# EAGLE design UNO_ESP8266_integrated (EAGLE 6.6.0)
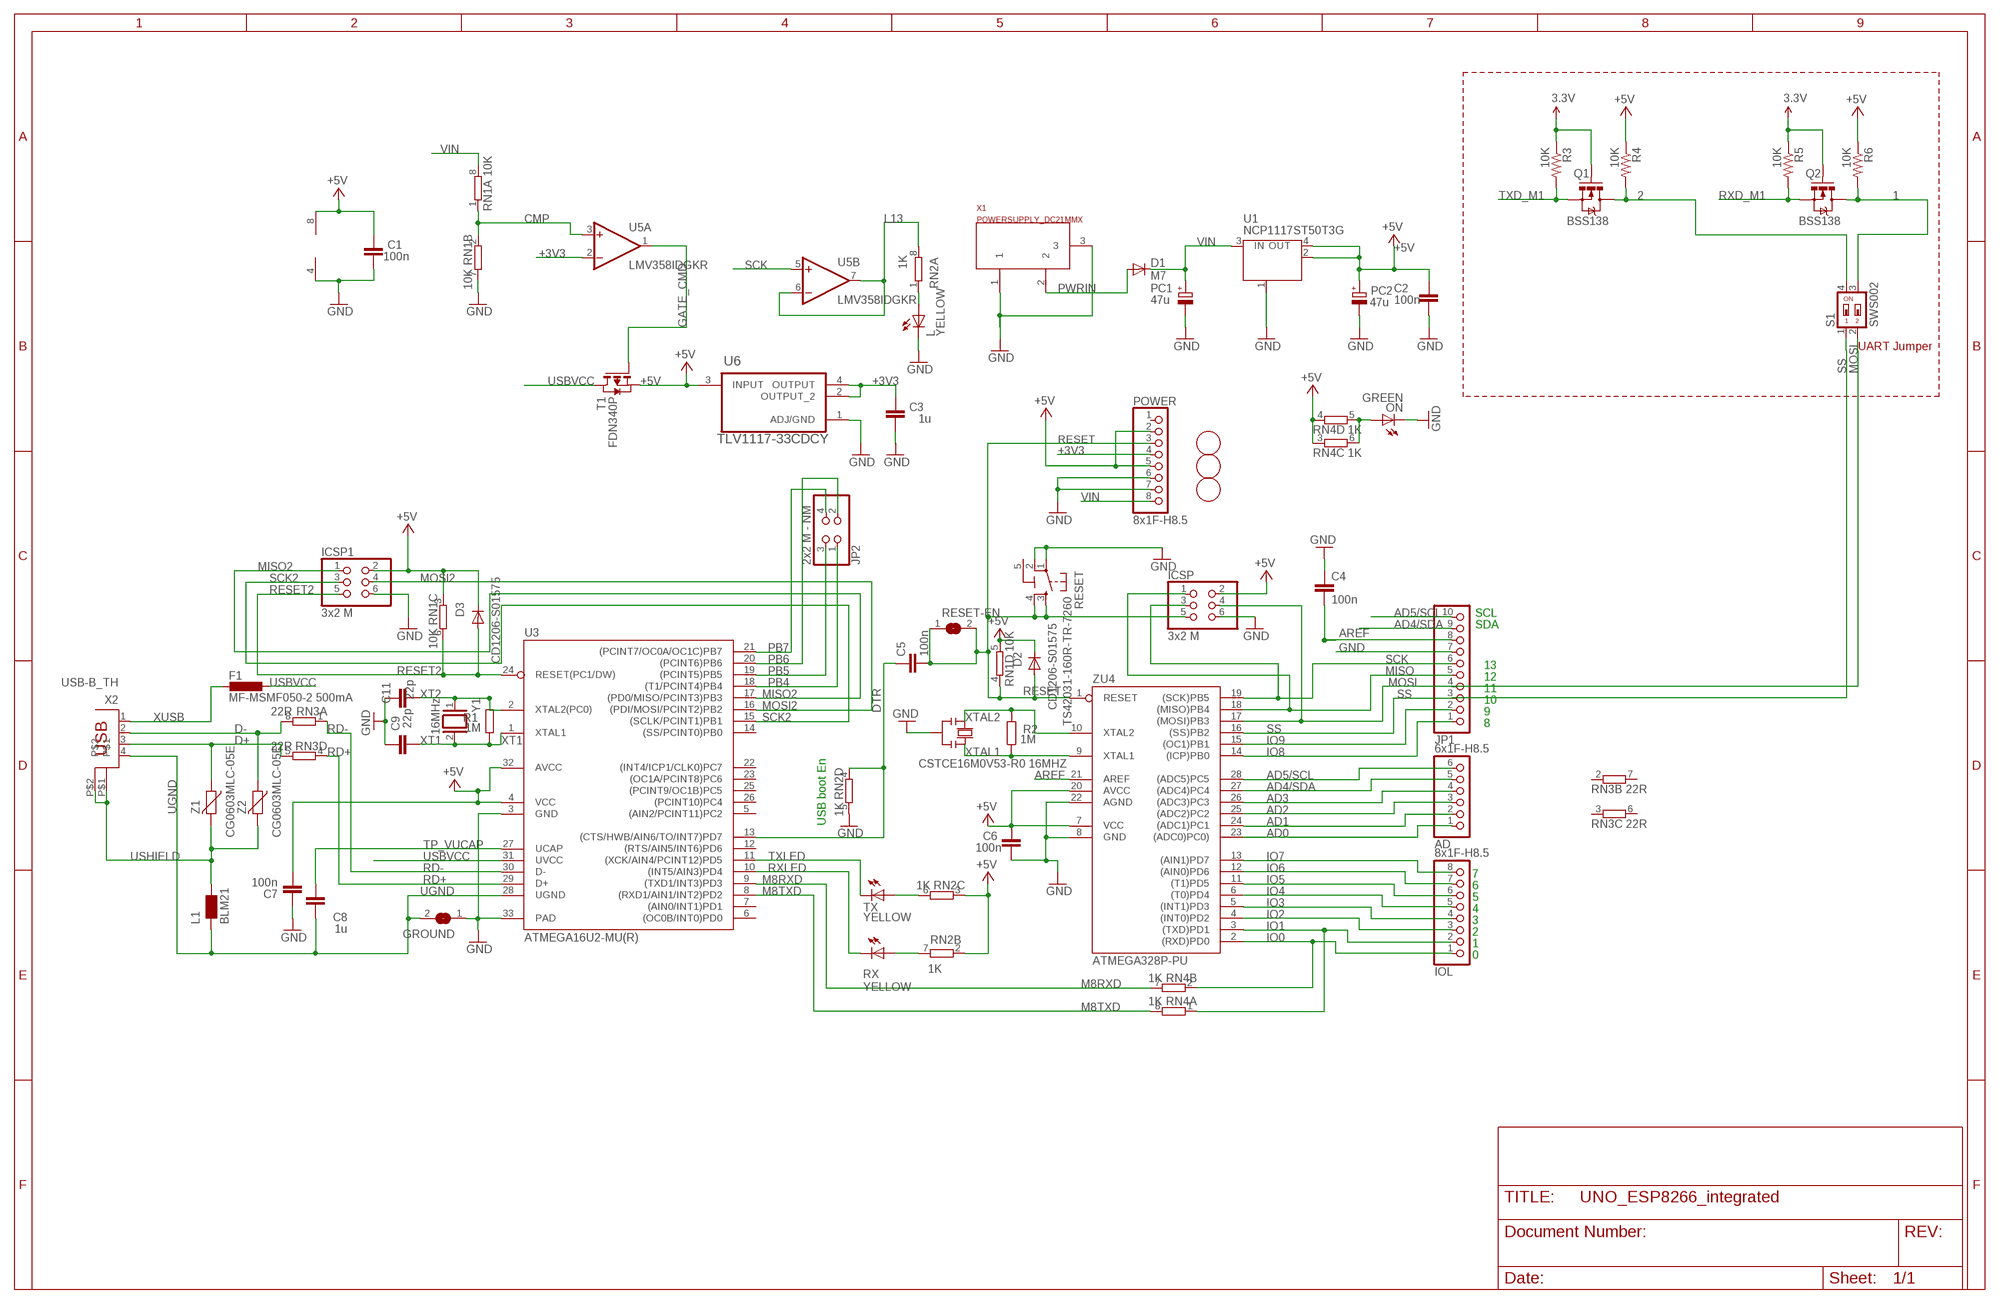
[diagram p0: schematic, sheet 1, part 1 of 2]
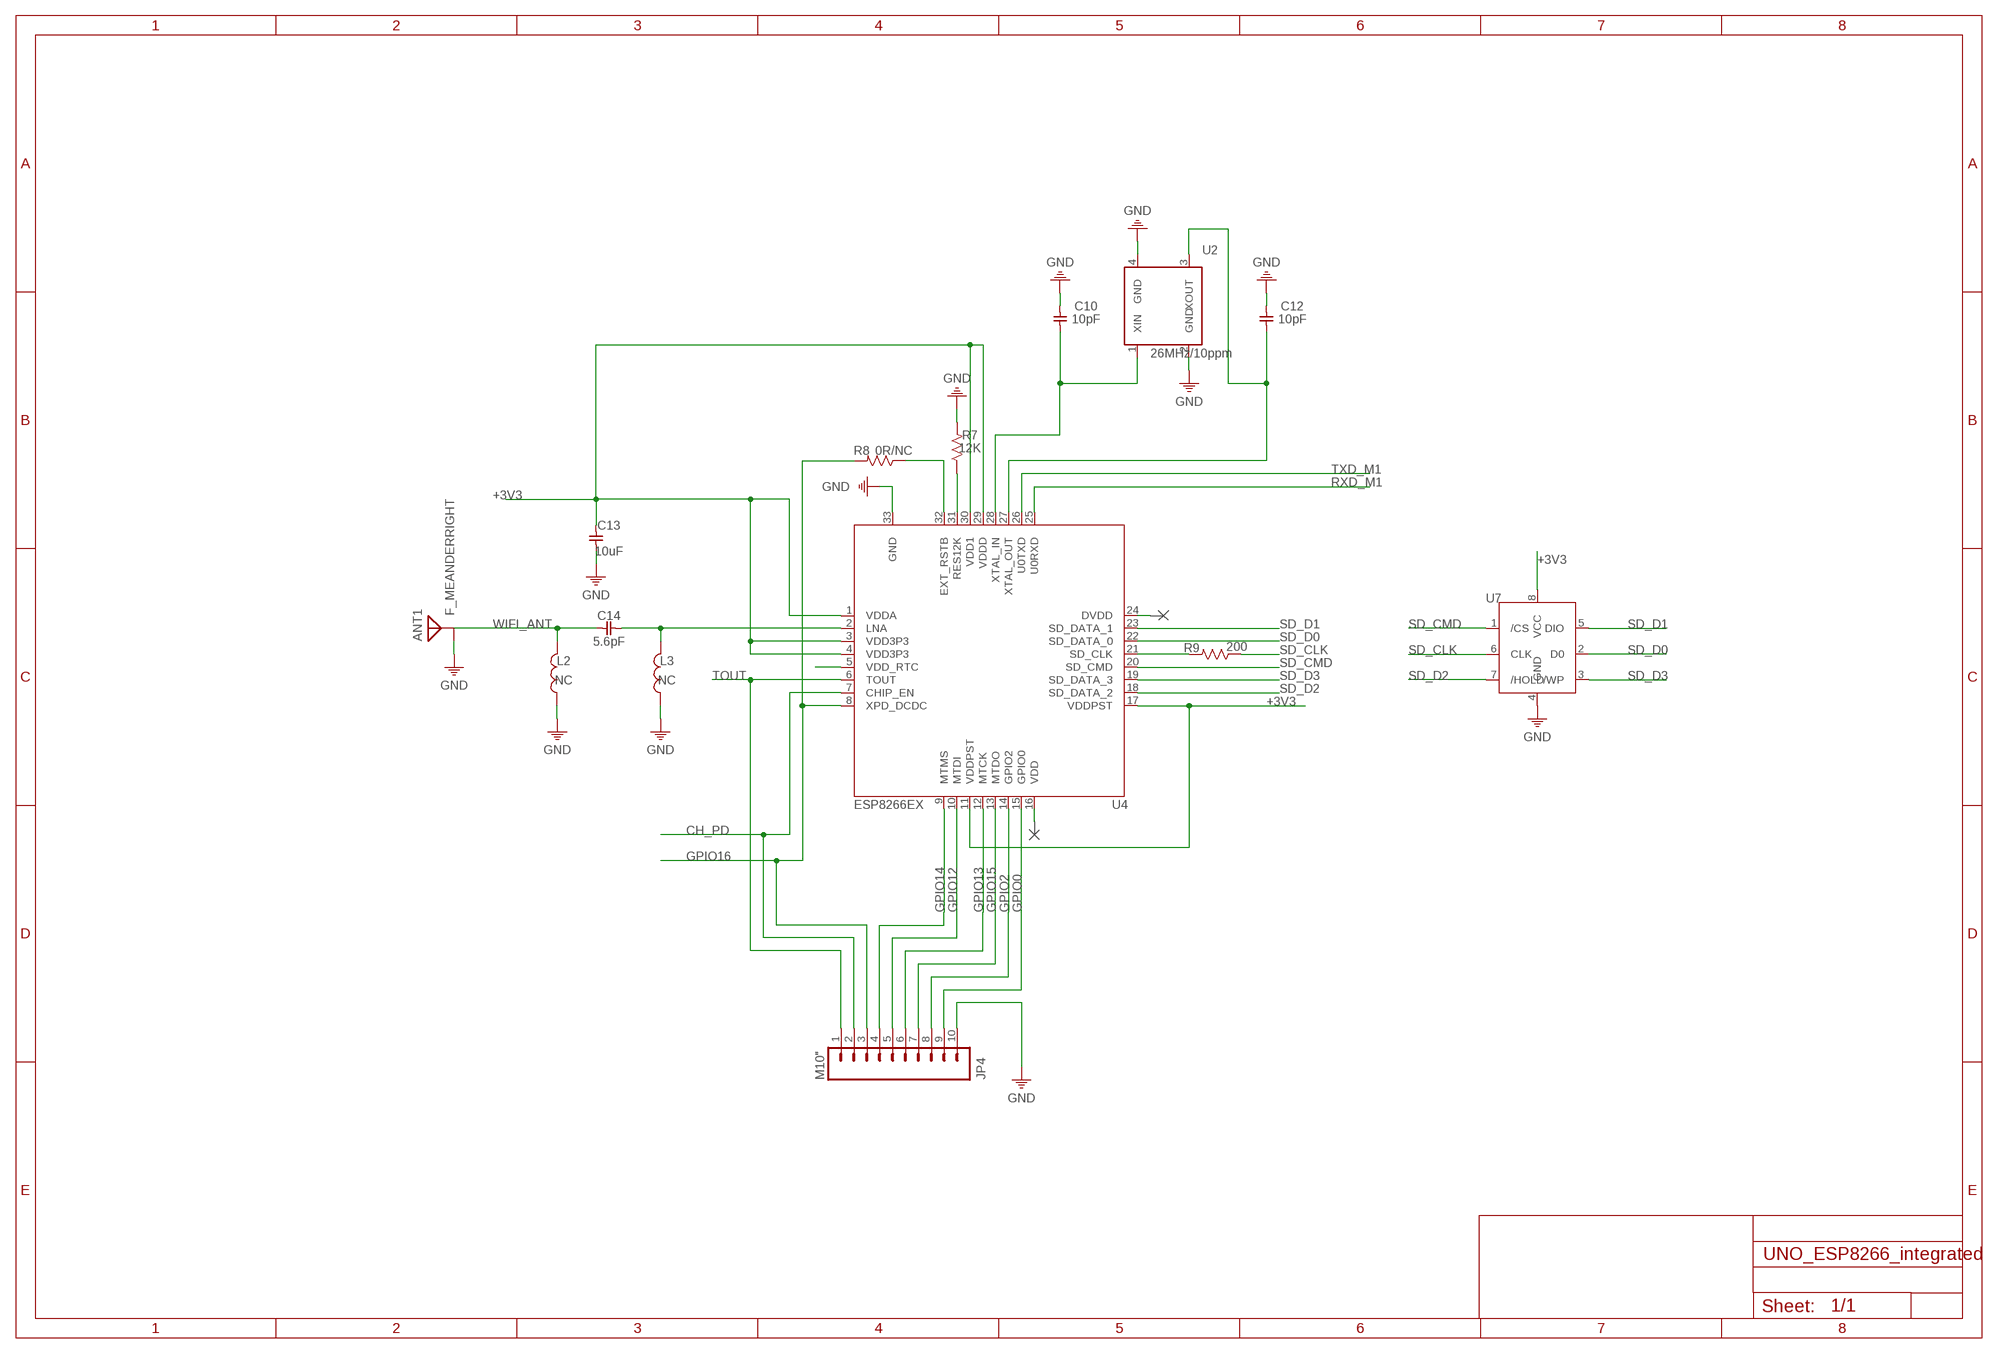
[diagram p1: schematic, sheet 1, part 2 of 2]
PORT1 (NC): BOM: EXCLUDE
PORT2 (NC): BOM: EXCLUDE

## Parts
AD  6x1F-H8.5  PINHD-1X6  [1X06]
ANT1  F_MEANDERRIGHT  [F_MEANDER_RIGHT]
C1  100n  C-EU0603-RND  [C0603-ROUND]
C2  100n  C-EU0603-RND  [C0603-ROUND]
C3  1u  C-EU0603-RND  [C0603-ROUND]
C4  100n  C-EU0603-RND  [C0603-ROUND]
C5  100n  C-EU0603-RND  [C0603-ROUND]
C6  100n  C-EU0603-RND  [C0603-ROUND]
C7  100n  C-EU0603-RND  [C0603-ROUND]
C8  1u  C-EU0603-RND  [C0603-ROUND]
C9  22p  C-EU0603-RND  [C0603-ROUND]
C10  10pF  CAP_0402  [C0402]
C11  22p  C-EU0603-RND  [C0603-ROUND]
C12  10pF  CAP_0402  [C0402]
C13  10uF  CAP_0402  [C0402]
C14  5.6pF  CAP_0402  [C0402]
D1  M7  DIODE-SMB  [SMB]
D2  CD1206-S01575  DIODE-MINIMELF  [MINIMELF]
D3  CD1206-S01575  DIODE-MINIMELF  [MINIMELF]
F1  MF-MSMF050-2 500mA  L-EUL1812  [L1812]
FD1  FIDUCIALMOUNT  [FIDUCIA-MOUNT]
FD2  FIDUCIALMOUNT  [FIDUCIA-MOUNT]
FD3  FIDUCIALMOUNT  [FIDUCIA-MOUNT]
GROUND  SJ  [SJ]
ICSP  3x2 M  PINHD-2X3  [2X03]
ICSP1  3x2 M  PINHD-2X3  [2X03]
IOL  8x1F-H8.5  PINHD-1X8  [1X08]
JP1  PINHD-1X10_ARD  [1X10]
JP2  2x2 M - NM  PINHD-2X2  [2X02]
JP4  M10"  [1X10]
L  YELLOW  LEDCHIP-LED0805  [CHIP-LED0805]
L1  BLM21  WE-CBF_0805  [0805]
L2  NC  FB_0603  [FB0603]
L3  NC  FB_0603  [FB0603]
ON  GREEN  LEDCHIP-LED0805  [CHIP-LED0805]
PC1  47u  CPOL-EUD  [PANASONIC_D]
PC2  47u  CPOL-EUD  [PANASONIC_D]
POWER  8x1F-H8.5  PINHD-1X8  [1X08]
Q1  BSS138  MOSFET-NCHANNELSMD  [SOT23-3]
Q2  BSS138  MOSFET-NCHANNELSMD  [SOT23-3]
R1  1M  R-EU_R0603  [R0603-ROUND]
R2  1M  R-EU_R0603  [R0603-ROUND]
R3  10K  RESISTOR0603-RES  [0603-RES]
R4  10K  RESISTOR0603-RES  [0603-RES]
R5  10K  RESISTOR0603-RES  [0603-RES]
R6  10K  RESISTOR0603-RES  [0603-RES]
R7  12K  RES_0402  [R0402]
R8  0R/NC  RES_0402  [R0402]
R9  200  RES_0402  [R0402]
RESET  TS42031-160R-TR-7260  TS42  [TS42]
RESET-EN  SJ  [SJ]
RN1  10K  4R-NCAY16  [CAY16]
RN2  1K  4R-NCAY16  [CAY16]
RN3  22R  4R-NCAY16  [CAY16]
RN4  1K  4R-NCAY16  [CAY16]
RX  YELLOW  LEDCHIP-LED0805  [CHIP-LED0805]
S1  SWS002  [SMS-002]
T1  FDN340P  PMOSSOT23  [SOT-23]
TX  YELLOW  LEDCHIP-LED0805  [CHIP-LED0805]
U1  NCP1117ST50T3G  MC33269ST-3.3T3  [SOT223]
U2  26MHz/10ppm  CRYSTAL_2SH  [CRYSTAL_32X25]
U3  ATMEGA16U2-MU(R)  ATMEGA16U2-MU  [MLF32]
U4  ESP8266EX  [QFN32]
U5  LMV358IDGKR  LMV358MMX  [MSOP08]
U6  TLV1117-33CDCY  [SOT230P700X180-4N]
U7  SPI_FLASH  [SOIC-8]
X1  POWERSUPPLY_DC21MMX  [POWERSUPPLY_DC-21MM]
X2  USB-B_TH  PN61729  [PN61729]
Y1  16MHz  XTAL/S  [QS]
Y2  CSTCE16M0V53-R0 16MHZ  RESONATORMU  [RESONATOR]
Z1  CG0603MLC-05E  VARISTORCN0603  [CT/CN0603]
Z2  CG0603MLC-05E  VARISTORCN0603  [CT/CN0603]
ZU4  ATMEGA328P-PU  [DIL28-3]

## Nets
1: Q2.3(D) R6.2 S1.3
2: Q1.3(D) R4.2 S1.4
+3V3: C3.2 C13.2 POWER.4 Q1.1(G) Q2.1(G) R3.1 R5.1 U4.1(VDDA) U4.3(VDD3P3) U4.4(VDD3P3) U4.11(VDDPST) U4.17(VDDPST) U4.29(VDDD) U4.30(VDD1) U5.2(A:-IN) U6.2(OUTPUT_2) U6.4(OUTPUT) U7.8(VCC) ; supply symbol labelled 3.3V
+5V [usbvcc]: C1.2 C2.2 C6.2 C7.1 D2.C D3.C ICSP1.2 ICSP.2 PC2.+ POWER.2 POWER.5 R4.1 R6.1 RN1.3 RN1.5 RN2.2 RN2.3 RN4.3 RN4.4 T1.2(S) U1.2(OUT) U1.4(OUT) U3.4(VCC) U3.32(AVCC) U5.8(P:V+) U6.3(INPUT) ZU4.7(VCC) ZU4.20(AVCC)
AD0: AD.1 ZU4.23((ADC0)PC0))
AD1: AD.2 ZU4.24((ADC1)PC1)
AD2: AD.3 ZU4.25((ADC2)PC2)
AD3: AD.4 ZU4.26((ADC3)PC3)
AD4/SDA: AD.5 JP1.9 ZU4.27((ADC4)PC4)
AD5/SCL: AD.6 JP1.10 ZU4.28((ADC5)PC5)
AREF [aref]: C4.2 JP1.8 ZU4.21(AREF)
CH_PD: JP4.2 U4.7(CHIP_EN)
CMP: RN1.1 RN1.2 U5.3(A:+IN)
D+: RN3.5 X2.3 Z1.1
D-: RN3.8 X2.2 Z2.1
DTR: C5.1 RN2.4 U3.13((CTS/HWB/AIN6/TO/INT7)PD7)
GATE_CMD: T1.3(G) U5.1(A:OUT)
GND [gnd]: ANT1.GND C1.1 C2.1 C3.1 C4.1 C6.1 C7.2 C9.2 C10.2 C11.2 C12.2 C13.1 GROUND.1 ICSP1.6 ICSP.6 JP1.7 JP4.10 L2.1 L3.1 L.C ON.C PC1.- PC2.- POWER.6 POWER.7 R7.2 RESET.1 RESET.2 RN1.7 RN2.5 U1.1(GND/ADJ) U2.2(GND) U2.4(GND) U3.3(GND) U3.33(PAD) U4.33(GND) U5.4(P:V-) U6.1(ADJ/GND) U7.4(GND) X1.1 X1.3 Y2.2 ZU4.8(GND) ZU4.22(AGND)
GPIO0: JP4.9 U4.15(GPIO0)
GPIO2: JP4.8 U4.14(GPIO2)
GPIO12: JP4.5 U4.10(MTDI)
GPIO13: JP4.6 U4.12(MTCK)
GPIO14: JP4.4 U4.9(MTMS)
GPIO15: JP4.7 U4.13(MTDO)
GPIO16: JP4.3 R8.2 U4.8(XPD_DCDC)
IO0: IOL.1 RN4.2 ZU4.2((RXD)PD0)
IO1: IOL.2 RN4.1 ZU4.3((TXD)PD1)
IO2: IOL.3 ZU4.4((INT0)PD2)
IO3: IOL.4 ZU4.5((INT1)PD3)
IO4: IOL.5 ZU4.6((T0)PD4)
IO5: IOL.6 ZU4.11((T1)PD5)
IO6: IOL.7 ZU4.12((AIN0)PD6)
IO7: IOL.8 ZU4.13((AIN1)PD7)
IO8: JP1.1 ZU4.14((ICP)PB0)
IO9: JP1.2 ZU4.15((OC1)PB1)
L13: RN2.8 U5.6(B:-IN) U5.7(B:OUT)
M8RXD: RN4.7 U3.9((TXD1/INT3)PD3)
M8TXD: RN4.8 U3.8((RXD1/AIN1/INT2)PD2)
MISO: ICSP.1 JP1.5 ZU4.18((MISO)PB4)
MISO2: ICSP1.1 U3.17((PD0/MISO/PCINT3)PB3)
MOSI: ICSP.4 JP1.4 S1.2 ZU4.17((MOSI)PB3)
MOSI2: ICSP1.4 U3.16((PDI/MOSI/PCINT2)PB2)
N$1: L.A RN2.1
N$2: R8.1 U4.32(EXT_RSTB)
N$3: ON.A RN4.5 RN4.6
N$4: R7.1 U4.31(RES12K)
N$5: U4.5(VDD_RTC)
N$6: U4.16(VDD)
N$7: U4.24(DVDD)
N$8: C14.1 L3.2 U4.2(LNA)
N$9: C10.1 U2.1(XIN) U4.28(XTAL_IN)
N$10: R9.2 U4.21(SD_CLK)
N$11: C12.1 U2.3(XOUT) U4.27(XTAL_OUT)
N$35: RN2.7 RX.A
N$36: RN2.6 TX.A
PB4: JP2.1 U3.18((T1/PCINT4)PB4)
PB5: JP2.3 U3.19((PCINT5)PB5)
PB6: JP2.2 U3.20((PCINT6)PB6)
PB7: JP2.4 U3.21((PCINT7/OC0A/OC1C)PB7)
PWRIN [power]: D1.A X1.2
RD+: RN3.4 U3.29(D+)
RD-: RN3.1 U3.30(D-)
RESET: C5.2 D2.A ICSP.5 POWER.3 RESET-EN.1 RESET-EN.2 RESET.3 RESET.4 RN1.4 ZU4.1(RESET)
RESET2: D3.A ICSP1.5 RN1.6 U3.24(RESET(PC1/DW))
RXD_M1: Q2.2(S) R5.2 U4.25(U0RXD)
RXLED: RX.C U3.10((INT5/AIN3)PD4)
SCK: ICSP.3 JP1.6 U5.5(B:+IN) ZU4.19((SCK)PB5)
SCK2: ICSP1.3 U3.15((SCLK/PCINT1)PB1)
SD_CLK: R9.1 U7.6(CLK)
SD_CMD: U4.20(SD_CMD) U7.1(/CS)
SD_D0: U4.22(SD_DATA_0) U7.2(D0)
SD_D1: U4.23(SD_DATA_1) U7.5(DIO)
SD_D2: U4.18(SD_DATA_2) U7.7(/HOLD)
SD_D3: U4.19(SD_DATA_3) U7.3(/WP)
SS: JP1.3 S1.1 ZU4.16((SS)PB2)
TOUT: JP4.1 U4.6(TOUT)
TP_VUCAP: C8.1 U3.27(UCAP)
TXD_M1: Q1.2(S) R3.2 U4.26(U0TXD)
TXLED: TX.C U3.11((XCK/AIN4/PCINT12)PD5)
UGND [gnd]: C8.2 GROUND.2 L1.1 U3.28(UGND) X2.4
USBVCC [usbvcc]: F1.1 T1.1(D) U3.31(UVCC)
USHIELD [gnd]: L1.2 X2.P$1 X2.P$2 Z1.2 Z2.2
VIN [power]: D1.C PC1.+ POWER.8 RN1.8 U1.3(IN)
WIFI_ANT: ANT1.RF C14.2 L2.2
XT1: C9.1 R1.1 U3.1(XTAL1) Y1.2
XT2: C11.1 R1.2 U3.2(XTAL2(PC0)) Y1.1
XTAL1: R2.1 Y2.3 ZU4.9(XTAL1)
XTAL2: R2.2 Y2.1 ZU4.10(XTAL2)
XUSB [usbvcc]: F1.2 X2.1
Unconnected: POWER.1 RN3.2 RN3.3 RN3.6 RN3.7 U3.5((AIN2/PCINT11)PC2) U3.6((OC0B/INT0)PD0) U3.7((AIN0/INT1)PD1) U3.12((RTS/AIN5/INT6)PD6) U3.14((SS/PCINT0)PB0) U3.22((INT4/ICP1/CLK0)PC7) U3.23((OC1A/PCINT8)PC6) U3.25((PCINT9/OC1B)PC5) U3.26((PCINT10)PC4)

## Notes on the sheet
- UART Jumper
- SCL
- SDA
- 13
- 12
- 11
- 10
- 9
- 8
- USB boot En
- 7
- 6
- 5
- 4
- 3
- 2
- 1
- 0

## Power pins joined to a net without a drawn wire
5-GND: RESET.5(5-GND)

## Library data of the parts
AD = SmartPrj:PINHD-1X6: PIN HEADER
ANT1 = ant-planar-1:F_MEANDER
C1-C9 C11 = SmartPrj:C-EU: CAPACITOR, European symbol
C10 C12-C14 = ESP8266:CAP_: Capacitor; SIZE: 0402
D1-D3 = diode:DIODE-: DIODE
F1 = rcl:L-EU: INDUCTOR, European symbol
FD1-FD3 = SmartPrj:FIDUCIALMOUNT
GROUND RESET-EN = jumper:SJ: SMD solder JUMPER
ICSP ICSP1 = SmartPrj:PINHD-2X3: PIN HEADER
IOL POWER = SmartPrj:PINHD-1X8: PIN HEADER
JP1 = SmartPrj:PINHD-1X10_ARD: PIN HEADER
JP2 = SmartPrj:PINHD-2X2: PIN HEADER
JP4 = SparkFun-Connectors:M10: Header 10 Standard 10-pin 0.1" header. Use with straight break away headers (SKU : PRT-00116), right angle break away headers (PRT-00553), swiss pins (PRT-00743), machine pins (PRT-00117), and female headers (PRT-00115).
L ON RX TX = led:LED: LED OSRAM: - CHIPLED LG R971, LG N971, LY N971, LG Q971, LY Q971, LO R971, LY R971 LH N974, LH R974 LS Q976, LO Q976, LY Q976 LO Q996 - Hyper CHIPLED LW Q18S LB Q993, LB Q99A, LB R99A - SideLED LS A670, LO A670, LY A670, LG A670, LP A670 LB A673, LV A673, LT A673, LW A673 LH A674 LY A675 LS A676, LA A676, LO A676, LY A676, LW A676 LS A679, LY A679, LG A679 - Hyper Micro SIDELED® LS Y876, LA Y876, LO Y876, LY Y876 LT Y87S - SmartLED LW L88C, LW L88S LB L89C, LB L89S, LG L890 LS L89K, LO L89K, LY L89K LS L896, LA L896, LO L896, LY L896 - TOPLED LS T670, LO T670, LY T670, LG T670, LP T670 LSG T670, LSP T670, LSY T670, LOP T670, LYG T670 LG T671, LOG T671, LSG T671 LB T673, LV T673, LT T673, LW T673 LH T674 LS T676, LA T676, LO T676, LY T676, LB T676, LH T676, LSB T676, LW T676 LB T67C, LV T67C, LT T67C, LS T67K, LO T67K, LY T67K, LW E67C LS E67B, LA E67B, LO E67B, LY E67B, LB E67C, LV E67C, LT E67C LW T67C LS T679, LY T679, LG T679 LS T770, LO T770, LY T770, LG T770, LP T770 LB T773, LV T773, LT T773, LW T773 LH T774 LS E675, LA E675, LY E675, LS T675 LS T776, LA T776, LO T776, LY T776, LB T776 LHGB T686 LT T68C, LB T68C - Hyper Mini TOPLED® LB M676 - Mini TOPLED Santana® LG M470 LS M47K, LO M47K, LY M47K Source: http://www.osram.convergy.de LUXEON: - LUMILED® LXK2-PW12-R00, LXK2-PW12-S00, LXK2-PW14-U00, LXK2-PW14-V00 LXK2-PM12-R00, LXK2-PM12-S00, LXK2-PM14-U00 LXK2-PE12-Q00, LXK2-PE12-R00, LXK2-PE12-S00, LXK2-PE14-T00, LXK2-PE14-U00 LXK2-PB12-K00, LXK2-PB12-L00, LXK2-PB12-M00, LXK2-PB14-N00, LXK2-PB14-P00, LXK2-PB14-Q00 LXK2-PR12-L00, LXK2-PR12-M00, LXK2-PR14-Q00, LXK2-PR14-R00 LXK2-PD12-Q00, LXK2-PD12-R00, LXK2-PD12-S00 LXK2-PH12-R00, LXK2-PH12-S00 LXK2-PL12-P00, LXK2-PL12-Q00, LXK2-PL12-R00 Source: www.luxeon.com KINGBRIGHT: KA-3528ASYC Source: www.kingbright.com
L1 = wuerth-elektronik:WE-CBF: SMD EMI Suppression Ferrite Beads - excellent anti-EMI properties - low DCR - impedances till 3000 ohms - rated current up to 6 A
L2 L3 = ESP8266:FB_: Ferrite Bead; SIZE: 0603
PC1 PC2 = rcl:CPOL-EU: POLARIZED CAPACITOR, European symbol
Q1 Q2 = SparkFun:MOSFET-NCHANNEL
R1 R2 = SmartPrj:R-EU_: RESISTOR, European symbol
R3-R6 = SparkFun:RESISTOR: Resistor Basic schematic elements and footprints for 0603, 1206, and PTH resistors.
R7-R9 = ESP8266:RES_: Resistor; SIZE: 0402
RESET = SmartPrj:TS42: TS42 Dongnan Electronics Tact switch VDC 12V - 50mA
RN1-RN4 = resistor-dil:4R-N: Array Chip Resistor Source: RS Component / Phycomp
S1 = smd-special:SWS002: SMD Dip Switch 2 pol.
T1 = zetex:PMOSSOT23: MOS FET
U1 = linear:MC33269ST*: Adjustable Output Low Dropout Voltage Regulator 800 mA Source: http://www.onsemi.com/pub/Collateral/MC33269-D.PDF
U2 = ESP8266:CRYSTAL_2SH: Crystal with 2 Shield Pads
U3 = SmartPrj:ATMEGA16U2-
U4 = ESP8266:ESP8266: 802.11bgn Smart Device
U5 = linear:LMV358?*: Dual General Purpose, Low Voltage, Rail-to-Rail Output Operational Amplifiers Source: http://www.national.com/mpf/LM/LMV321.html http://www.national.com/dt/lmv_qual.pdf
U6 = TLV1117-33CDCY:TLV1117-33CDCY: V REG, LDO, 3.3V, 0.8A; MPN: TLV1117-33CDCY; OC_FARNELL: 1494942; OC_NEWARK: 67K8520; PACKAGE: SOT-223-3; SUPPLIER: TEXAS INSTRUMENTS
U7 = ESP8266:SPI_FLASH: SPI Flash
X1 = SmartPrj:POWERSUPPLY_DC21MM
X2 = SmartPrj:PN61729: BERG USB connector
Y1 = SmartPrj:XTAL/S: CRYSTAL
Y2 = SmartPrj:RESONATOR
Z1 Z2 = varistor:VARISTOR: VARISTOR
ZU4 = SmartPrj:ATMEGA328P-: MICROCONTROLLER 4 Kbytes FLASH 128 bytes SRAM 256 bytes EEPROM UART 6-channel 10 bit ADC

## Net classes
0 default: width 0.2 mm, drill 0.2 mm, clearance 0.2 mm
1 power: width 0.2 mm, drill 0.2 mm, clearance 0.2 mm
2 gnd: width 0.2 mm, drill 0.2 mm, clearance 0.2 mm
3 usbvcc: width 0.2 mm, drill 0.2 mm, clearance 0.2 mm
4 aref: width 0.2 mm, drill 0.2 mm, clearance 0.2 mm

## Board
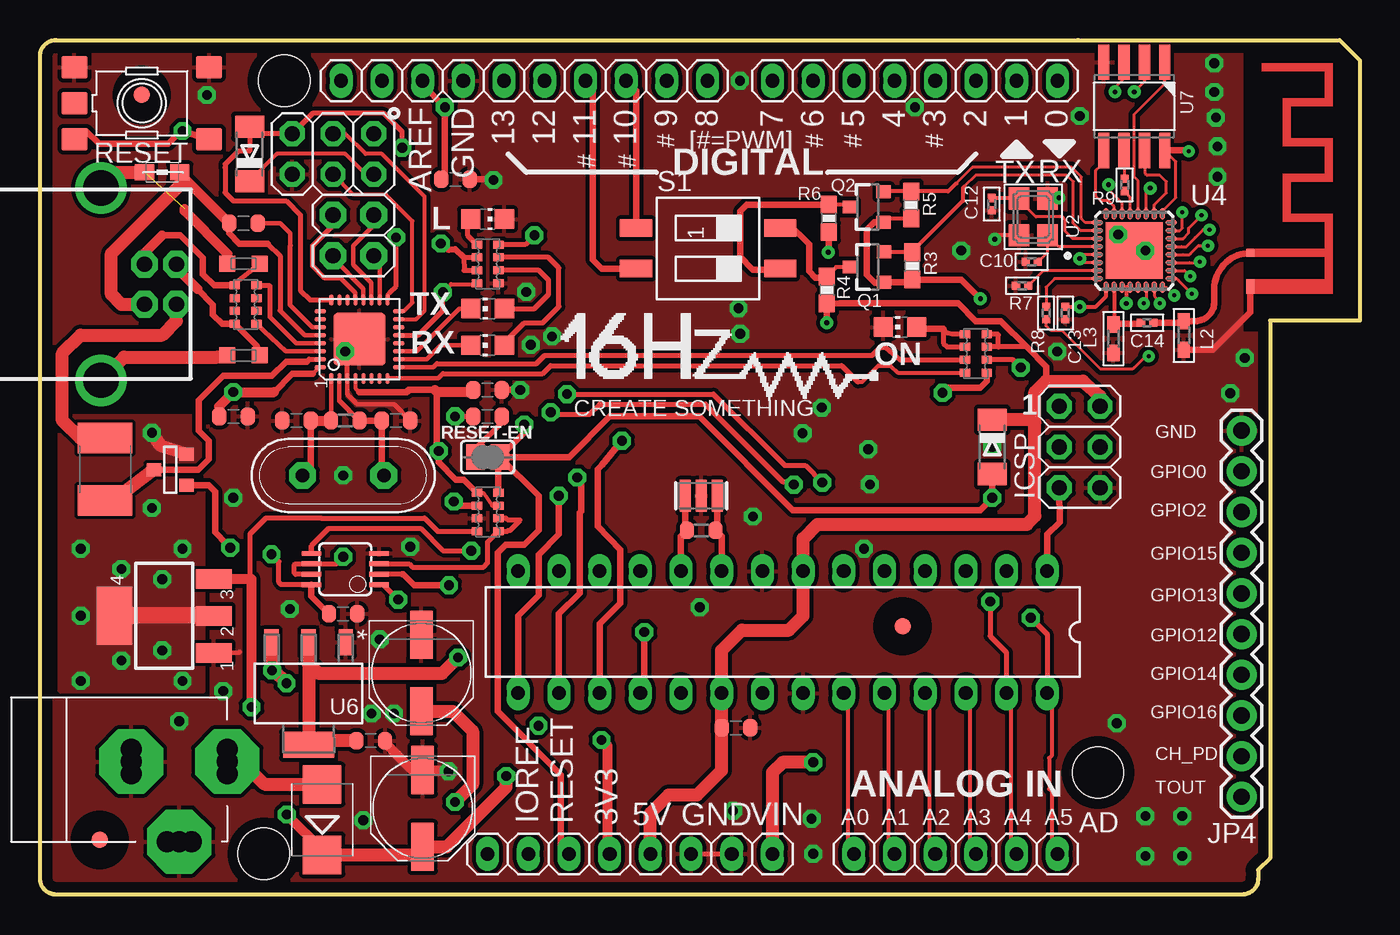
[diagram p2: board, top side]
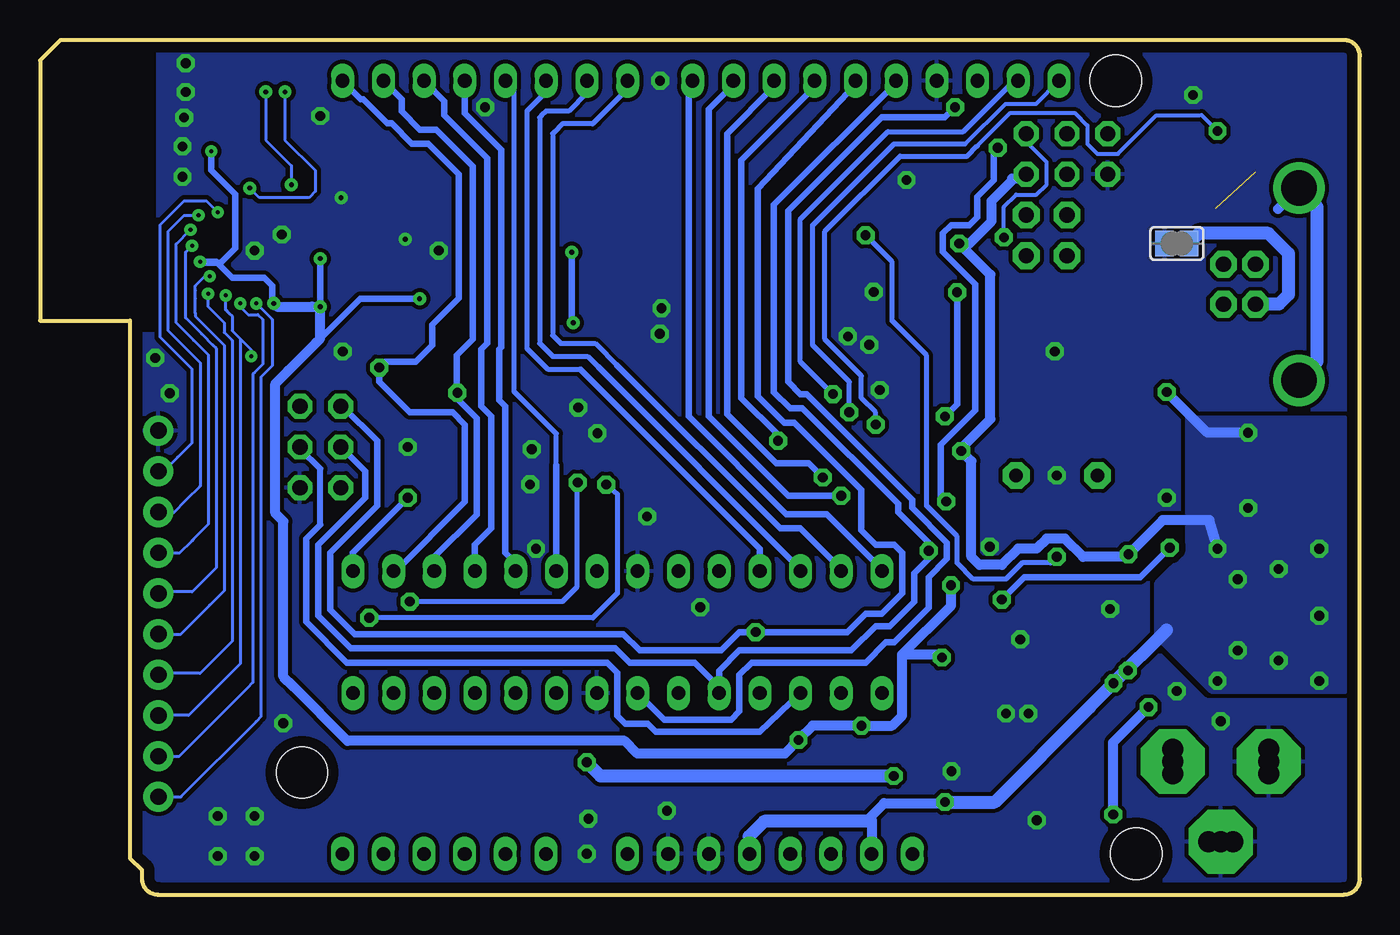
[diagram p3: board, bottom side, seen from below]

Size 82.39 x 53.34 mm. Coordinates in mm from the lower left corner, seen from the top.
Outline: 64.77,53.34 1,53.34 arc90 0,52.34 0,1 arc90 1,0 75.04,0 arc90 76.04,1 76.04,1.54 76.78,2.28 76.78,35.83 82.39,35.83 82.39,52.07 81.12,53.34 64.77,53.34
Outline: 64.77,53.34 64.82,53.34
Copper layers (1*16): Top 0.035mm / dielectric 1.5mm / Bottom 0.035mm
Design rules "default *": minimum track width 0.2mm, minimum drill 10mil, track to track 0.16mm, track to pad 0.16mm, pad to pad 0.16mm, via to via 0.16mm, smd to smd 0.16mm, copper to edge 26mil, drill to drill 12mil, minimum pad ring 10mil, minimum via ring 10mil, stop-mask expansion 1mil, vias tented up to drill 30mil, thermal gap 10mil
Holes 3.2 mm at 66.04,7.62 15.24,50.8 13.97,2.54
vRestrict: area 22.9,44.1 to 24.7,49.2; area 25.4,45.5 to 27.1,49.2; area 28.5,45.4 to 29.6,48.8; area 31,45.4 to 32.2,48.8; area 33.6,45.4 to 34.7,48.8; area 36.1,45.4 to 37.3,48.8; area 38.8,47.3 to 39.9,48.8; area 40.3,45.1 to 47.7,46.9; area 60.4,44.2 to 61.8,46.8; area 62.9,44.2 to 64.3,46.8; area 61.4,35.8 to 64.8,37.2; area 0.7,21.9 to 2.1,30.1; 14 more areas

### Footprints (pad centres in the part's own frame; a part is rotated, then mirrored left to right if it is on the bottom)
1X06 = drill 0.85 pad 1.422 long: 1 -6.35,0; 2 -3.81,0; 3 -1.27,0; 4 1.27,0; 5 3.81,0; 6 6.35,0
F_MEANDER_RIGHT = smd 0.9 x 0.5: GND -0.45,-0.25 | smd 0.5 x 0.5: RF -2.55,-0.25
C0603-ROUND = smd 0.898 x 1.1: 1 -0.889,0; 2 0.889,0
C0402 = smd 0.508 x 0.508: 1 -0.381,0; 2 0.381,0
SMB = smd 2.4 x 2.4: A 2.2,0; C -2.2,0
MINIMELF = smd 1.4 x 1.8: A 1.7,0; C -1.7,0
L1812 = smd 1.9 x 3.4: 1 -1.95,0; 2 1.95,0
FIDUCIA-MOUNT = smd 1.016 x 1.016: P$1 0,0
SJ = smd 1.168 x 1.6: 1 -0.762,0; 2 0.762,0
2X03 = drill 0.95 pad 1.55 octagon: 1 -2.54,-1.27; 2 -2.54,1.27; 3 0,-1.27; 4 0,1.27; 5 2.54,-1.27; 6 2.54,1.27
1X08 = drill 0.85 pad 1.422 long: 1 -8.89,0; 2 -6.35,0; 3 -3.81,0; 4 -1.27,0; 5 1.27,0; 6 3.81,0; 7 6.35,0; 8 8.89,0
1X10 = drill 0.85 pad 1.422 long: 1 -11.43,0; 2 -8.89,0; 3 -6.35,0; 4 -3.81,0; 5 -1.27,0; 6 1.27,0; 7 3.81,0; 8 6.35,0; 9 8.89,0; 10 11.43,0
2X02 = drill 0.95 pad 1.676 octagon: 1 -1.27,-1.27; 2 -1.27,1.27; 3 1.27,-1.27; 4 1.27,1.27
1X10' = drill 1.016 pad 1.88: 1 0,0; 2 2.54,0; 3 5.08,0; 4 7.62,0; 5 10.16,0; 6 12.7,0; 7 15.24,0; 8 17.78,0; 9 20.32,0; 10 22.86,0
CHIP-LED0805 = smd 1.2 x 1.2: A 0,-1.05; C 0,1.05
0805 = smd 1.2 x 1: 1 -1.1,0; 2 1.1,0
FB0603 = smd 1.016 x 0.762: 1 -0.889,0; 2 0.889,0
PANASONIC_D = smd 3 x 1.4: + 2.4,0; - -2.4,0
SOT23-3 = smd 0.8 x 0.9: 1 -0.95,-1; 2 0.95,-1; 3 0,1.1
R0603-ROUND = smd 0.898 x 1.1: 1 -0.889,0; 2 0.889,0
0603-RES = smd 1.1 x 1: 1 -0.85,0; 2 0.85,0
R0402 = smd 0.508 x 0.508: 1 -0.381,0; 2 0.381,0
TS42 = smd 1.6 x 1.4: 1 -4.2,2.25; 2 4.2,2.25; 3 -4.2,-2.25; 4 4.2,-2.25; 5 -4.2,0
CAY16 = smd 0.5 x 0.65: 1 -1.2,-0.675; 2 -0.4,-0.675; 3 0.4,-0.675; 4 1.2,-0.675; 5 1.2,0.675; 6 0.4,0.675; 7 -0.4,0.675; 8 -1.2,0.675
SMS-002 = smd 1.092 x 2.007: 1 -1.27,-4.496; 2 1.27,-4.496; 3 1.27,4.496; 4 -1.27,4.496
SOT-23 = smd 0.787 x 0.889: 1 0.025,-1.016; 2 -0.94,1.016; 3 0.991,1.016
SOT223 = smd 1.219 x 2.235: 1 -2.311,-3.099; 2 0,-3.099; 3 2.311,-3.099 | smd 3.6 x 2.2: 4 0,3.099
CRYSTAL_32X25 = smd 1.27 x 1.397: 1 -0.889,1.143; 2 -0.889,-1.143; 3 0.889,-1.143; 4 0.889,1.143
MLF32 = smd 0.7 x 0.28: 1 -2.45,1.75; 2 -2.45,1.25; 3 -2.45,0.75; 4 -2.45,0.25; 5 -2.45,-0.25; 6 -2.45,-0.75; 7 -2.45,-1.25; 8 -2.45,-1.75; 17 2.45,-1.75; 18 2.45,-1.25; 19 2.45,-0.75; 20 2.45,-0.25; 21 2.45,0.25; 22 2.45,0.75; 23 2.45,1.25; 24 2.45,1.75 | smd 0.28 x 0.7: 9 -1.75,-2.45; 10 -1.25,-2.45; 11 -0.75,-2.45; 12 -0.25,-2.45; 13 0.25,-2.45; 14 0.75,-2.45; 15 1.25,-2.45; 16 1.75,-2.45; 25 1.75,2.45; 26 1.25,2.45; 27 0.75,2.45; 28 0.25,2.45; 29 -0.25,2.45; 30 -0.75,2.45; 31 -1.25,2.45; 32 -1.75,2.45 | smd 3.254 x 3.254: 33 0,0
QFN32 = smd 0.7 x 0.3: 1 -2.3,1.75; 2 -2.3,1.25; 3 -2.3,0.75; 4 -2.3,0.25; 5 -2.3,-0.25; 6 -2.3,-0.75; 7 -2.3,-1.25; 8 -2.3,-1.75; 17 2.3,-1.75; 18 2.3,-1.25; 19 2.3,-0.75; 20 2.3,-0.25; 21 2.3,0.25; 22 2.3,0.75; 23 2.3,1.25; 24 2.3,1.75 | smd 0.3 x 0.7: 9 -1.75,-2.3; 10 -1.25,-2.3; 11 -0.75,-2.3; 12 -0.25,-2.3; 13 0.25,-2.3; 14 0.75,-2.3; 15 1.25,-2.3; 16 1.75,-2.3; 25 1.75,2.3; 26 1.25,2.3; 27 0.75,2.3; 28 0.25,2.3; 29 -0.25,2.3; 30 -0.75,2.3; 31 -1.25,2.3; 32 -1.75,2.3 | smd 3.53 x 3.53: 33 0,0
MSOP08 = smd 0.3 x 1.2: 1 -0.976,-2.113; 2 -0.326,-2.113; 3 0.324,-2.113; 4 0.974,-2.113; 5 0.974,2.112; 6 0.324,2.112; 7 -0.326,2.112; 8 -0.976,2.112
SOT230P700X180-4N = smd 1.626 x 0.889: 1 -3.2,2.311; 2 -3.2,0; 3 -3.2,-2.311 | smd 1.626 x 3.175: 4 3.2,0
SOIC-8 = smd 0.7 x 2.2: 1 -1.905,-2.75; 2 -0.635,-2.75; 3 0.635,-2.75; 4 1.905,-2.75; 5 1.905,2.75; 6 0.635,2.75; 7 -0.635,2.75; 8 -1.905,2.75
POWERSUPPLY_DC-21MM = drill 1.3 pad 4 octagon: 1 -5.08,-3.353; 2 -0.076,-6.35; 3 -0.076,-0.356 | drill 1.3: 4 -5.08,-4.115; 5 -5.08,-2.591; 6 -0.838,-0.356; 7 0.686,-0.356; 8 -0.838,-6.35; 9 0.686,-6.35
PN61729 = drill 0.95 pad 1.676 octagon: 1 1.25,4.71; 2 -1.25,4.71; 3 -1.25,2.71; 4 1.25,2.71 | drill 2.2: P$1 -6,0; P$2 6,0
QS = drill 0.85 pad 1.676 octagon: 1 -2.54,0; 2 2.54,0
RESONATOR = smd 0.7 x 2: 1 -1,0; 2 0,0; 3 1,0
CT/CN0603 = smd 1 x 1: 1 -1,0; 2 1,0
DIL28-3 = drill 0.85 pad 1.422 long: 1 -16.51,-3.81; 2 -13.97,-3.81; 3 -11.43,-3.81; 4 -8.89,-3.81; 5 -6.35,-3.81; 6 -3.81,-3.81; 7 -1.27,-3.81; 8 1.27,-3.81; 9 3.81,-3.81; 10 6.35,-3.81; 11 8.89,-3.81; 12 11.43,-3.81; 13 13.97,-3.81; 14 16.51,-3.81; 15 16.51,3.81; 16 13.97,3.81; 17 11.43,3.81; 18 8.89,3.81; 19 6.35,3.81; 20 3.81,3.81; 21 1.27,3.81; 22 -1.27,3.81; 23 -3.81,3.81; 24 -6.35,3.81; 25 -8.89,3.81; 26 -11.43,3.81; 27 -13.97,3.81; 28 -16.51,3.81

### Placement (x,y rotation side)
AD  57.15,2.54 0 top
ANT1  75.8,37.5 270 top
C1  18.92,17.53 180 top
C2  12.06,29.84 180 top
C3  20.64,9.61 180 top
C4  25.94,44.65 180 top
C5  27.94,29.84 0 top
C6  43.43,10.41 180 top
C7  27.94,31.5 0 top
C8  12.7,41.91 180 top
C9  16,29.59 180 top
C10  61.9,39.5 180 top
C11  22.22,29.59 0 top
C12  59.4,43.1 270 top
C13  64,36.3 90 top
C14  69.1,35.7 0 top
D1  17.61,4.67 90 top
D2  59.44,27.94 270 top
D3  13.08,46.23 90 top
F1  4.06,26.54 90 top
FD1  6.35,49.91 0 top
FD2  53.84,16.74 0 top
FD3  3.73,3.41 0 top
GROUND  11.43,40.64 0 bottom
ICSP  64.9,27.94 270 top
ICSP1  18.29,46.23 180 top
IOL  54.61,50.8 180 top
JP1  30.23,50.8 180 top
JP2  19.56,41.15 90 top
JP4  M10"  [1X10']  75,6.1 90 top
L  27.94,42.16 270 top
L1  7.62,45.09 180 top
L2  71.4,34.9 90 top
L3  67,34.7 90 top
ON  53.68,35.42 90 top
PC1  23.89,5.37 270 top
PC2  23.8,13.83 270 top
POWER  36.83,2.54 0 top
Q1  51.67,39.17 90 top
Q2  51.66,42.92 90 top
R1  19.05,29.59 0 top
R2  41.27,22.73 180 top
R3  54.45,39.24 90 top
R4  49.12,37.74 90 top
R5  54.38,43.04 90 top
R6  49.23,42.21 90 top
R7  61.3,38 180 top
R8  62.8,36.3 270 top
R9  67.7,44.3 270 top
RESET  6.35,49.4 0 top
RESET-EN  27.94,27.3 0 top
RN1  27.94,23.88 90 top
RN2  27.94,39.37 270 top
RN3  12.83,36.83 90 top
RN4  58.42,33.78 90 top
RX  27.94,34.29 90 top
S1  41.7,40.34 270 top
T1  8.13,26.54 270 top
TX  27.94,36.58 90 top
U1  7.75,17.4 90 top
U2  62,42.3 180 top
U3  19.94,34.67 90 top
U4  68.3,40.2 90 top
U5  19.05,20.32 90 top
U6  16.76,12.55 270 top
U7  68.3,49.2 180 top
X1  5.33,8.38 90 top
X2  3.81,38.1 270 top
Y1  18.92,26.16 180 top
Y2  41.27,24.89 0 top
Z1  12.7,39.37 180 top
Z2  12.7,33.66 180 top
ZU4  46.36,16.38 180 top

### Tracks (layer width: path | path; a pad name or v marks a point on that pad's centre or on a via)
1
  Top 0.254: Q2.3 50.41,43.06 R6.2
  Top 0.406: R6.2 44.66,43.06 44.11,43.06 43.99,42.94 43.7,42.65 43.7,42.1 43.7,39.81 44.5,39.01 46.13,39.01 S1.3
2
  Top 0.254: Q1.3 49.7,39.17 R4.2
  Top 0.406: R4.2 49.03,38.5 48.4,38.5 48,38.9 48,40.6 47.63,40.97 47,41.61 S1.4
+3V3  (via drill 0.25, 0.3, 0.6, 0.61)
  Top 0.2: U4.17 70.05,42.65 70.9,43.5 70.9,45.76 U7.8 | 70.65,39.4 U4.11 71.75,39.45 72.05,39.45 72.35,39.45 v72.4,39.5 | U4.30 65.15,39.45 v64.9,39.7 65.15,39.95 U4.29
  Top 0.254: C13.2 63.88,36.7 v64.9,36.7 65.9,36.7 66.5,37.3 66.55,37.35 U4.1 | U4.3 67.8,37.9 | 67.8,37.9 U4.4 | U4.4 67.8,37.9 | U4.4 67.8,37.9 | 67.8,37.9 v67.8,36.9 | R5.1 52.88,42.19 Q2.1
  Top 0.305: 22.61,19.99 U5.2
  Top 0.406: 22.61,19.99 22.68,19.99 23.37,19.3 v25.53,19.3 | Q2.1 52.07,41.97 51.6,41.5 51.6,38.7 52.1,38.2 52.65,38.2 Q1.1 54.28,38.22 R3.1 57.51,38.39 v58.7,37.2 | 70.25,46.4 U7.8 71.65,46.45 v71.7,46.4
  Top 0.61: POWER.4 35.43,2.67 35.43,6.22 35.43,9.27 v35.05,9.65
  Top 0.813: C3.2 17.03,9.61 U6.4 16.76,14.34 | 16.76,14.34 U6.2 16.76,14.34 | 16.76,14.34 16.86,14.34 17.3,13.9 17.4,13.8 24.9,13.8 25.1,13.8 v26.1,14.8
  Bottom 0.406: v64.9,39.7 v64.9,36.7 | v58.7,37.2 62.4,37.2 65.15,34.45 | v67.8,36.9 67.9,37 67.9,38 68.4,38.5 70.4,38.5 71.4,39.5 v72.4,39.5 72.35,39.45 71.1,39.45 70.2,40.35 70.2,43.7 71.7,45.2 v71.7,46.4
  Bottom 0.61: 28.57,14.99 28.57,11.18 29.21,10.54 v31.11,10.54 34.16,10.54 v35.05,9.65 35.9,8.8 45.1,8.8 45.9,9.6 63.2,9.6 66.6,13 67.2,13.6 67.2,23.3 67.7,23.8 67.7,31.9 66.9,32.7 65.15,34.45 64.9,34.7 v64.9,36.7 65.4,36.7 67.6,36.7 v67.8,36.9 | 28.57,14.99 25.53,18.03 v25.53,19.3 | 28.57,14.99 26.29,14.99 v26.1,14.8
+5V  (via drill 0.3, 0.6, 0.61)
  Top 0.254: 27.32,25.02 RN1.5 27.65,25.08 28.23,24.28 RN1.3 | ICSP1.2 20.32,44.96 19.05,46.23 14.78,46.23 D3.C | 49.23,40.14 v49.2,40.1 | 49.12,35.72 v49.1,35.7 | 17.02,32.51 17.43,32.92 U3.32 | 19.94,31.37 19.69,31.62 19.69,31.75 U3.4
  Top 0.305: 61.58,34.18 59.82,34.18 | 59.82,34.18 RN4.3 | RN4.4 59.76,34.98 59.82,34.93 59.82,34.18 | RN2.2 26.43,39.77 26.47,38.97 RN2.3 | 25.1,40.72 v25.02,40.64 | v14.49,13.99 14.54,14.04 | U5.8 15.06,19.34 14.9,19.5 14.9,20.79 v14.44,21.24
  Top 0.406: 42.55,10.16 42.35,10.35 | 26.43,39.77 25.93,40.28 25.53,40.26 v25.02,40.64 | RN1.5 26.43,25.91 25.96,25.91 24.89,26.97 v24.89,27.69 24.76,28.19 24.76,31.38 | 24.64,31.51 23.03,31.51 22.89,31.37 19.94,31.37 | 17.02,32.51 15.75,32.51 14.61,31.37 | U5.8 16.94,18.62 C1.2 | 62.87,32.05 62.8,32.12 62.8,32.96 61.58,34.18 59.96,35.8 58.4,35.8 57.3,36.9 53.8,36.9 49.91,36.9 R4.1 49.12,35.72 v49.1,35.7 | R6.1 49.23,40.14 v49.2,40.1
  Top 0.508: 11.02,17.42 U1.2 | ICSP.2 66.04,30.48
  Top 0.61: C6.2 42.58,10.88 42.55,11.43 | 24.64,31.51 24.76,31.38 26.94,31.38 C7.1 | 11.05,29.72 C2.2 11.18,30.48 v12.06,31.37 14.61,31.37 | 25.1,40.72 v25.02,40.64
  Top 0.813: 66.17,30.44 ICSP.2 66.17,31.11 65.1,32.05 62.87,32.05 62.79,32.05 62.1,31.37 62.1,29.46 | 62.1,29.46 62.1,23.62 61.59,23.11 48.51,23.11 47.62,22.22 ZU4.7 47.62,17.4 46.74,16.51 43.82,16.51 42.55,15.24 ZU4.20 42.55,11.43 C6.2 42.55,10.16 42.55,7.75 41.02,6.22 39.24,6.22 38.1,5.08 POWER.5 | T1.2 7.57,27.99 v6.99,28.83 | D2.C 61.93,29.64 62.1,29.46 | PC2.+ 25.77,11.43 27,10.2 27,6.87 v25.9,5.77 | U6.3 14.45,14.12 14.54,14.04 v15.39,13.19
  Top 1.016: U1.4 5.84,17.4 5.87,17.42 11.02,17.42
  Bottom 0.406: v49.2,40.1 49.2,35.8 v49.1,35.7
  Bottom 0.61: ICSP1.2 21.08,44.7 21.72,44.7 21.72,44.58 22.99,43.31 22.99,42.04 24.38,40.64 v25.02,40.64 23.07,38.69 23.07,29.68 24.89,27.85 v24.89,27.69 24.26,27.05 24.26,21.08 23.75,20.57 22.35,20.57 21.34,21.59 20.19,21.59 19.56,22.22 18.41,22.22 17.27,21.08 14.61,21.08 v14.44,21.24 12.32,23.37 9.4,23.37 v8.89,21.59 | POWER.2 30.48,4.7 30.61,4.57 30.61,4.79 29.7,5.7 25.97,5.7 v25.9,5.77 | v12.06,31.37 9.53,28.83 v6.99,28.83
  Bottom 0.813: POWER.5 38.12,3.63 37.19,4.57 30.61,4.57 | 12.06,16.51 v15.39,13.19 16.89,11.68 22.8,5.77 v25.9,5.77
  other vias: 2.54,21.59 5.08,20.32 6.99,24.13 2.54,13.33 5.08,14.6 2.54,17.4 8.89,13.33 7.62,15.24 7.62,19.68
  pour Bottom (isolate 0.406, no thermals): 0.89,29.72 10.79,29.72 10.79,21.34 12.7,19.43 12.7,16.13 9.27,12.7 0.89,12.7
  pour Top (no thermals): 1.27,12.7 1.27,29.84 10.16,29.84 10.16,12.7
AD0
  Top 0.254: ZU4.23 50.44,12.17 50.44,3 AD.1
AD1
  Top 0.254: ZU4.24 52.98,12.17 52.98,3 AD.2
AD2
  Top 0.254: ZU4.25 55.52,12.17 55.52,3 AD.3
AD3
  Top 0.254: ZU4.26 58.06,12.17 58.06,3 AD.4
AD4/SDA  (via drill 0.61)
  Top 0.254: ZU4.27 60.6,12.17 60.6,3 AD.5
  Top 0.305: v32.89,31.24 42.04,31.24 46.48,26.8 47.75,26.8 v48.83,25.72 49.02,25.65 | v59.31,18.29 59.31,16.13 60.33,15.11 ZU4.27
  Bottom 0.305: JP1.9 21.59,50.8 24.76,47.62 29.46,47.62 34.93,42.16 34.93,33.27 v32.89,31.24 | v48.83,25.72 48.9,25.65 48.9,19.18 49.78,18.29 v59.31,18.29
AD5/SCL  (via drill 0.61)
  Top 0.254: ZU4.28 63.14,12.17 63.14,8.66 62.99,8.51 62.99,6.6 63.14,6.45 63.14,3 AD.6
  Top 0.305: v31.88,30.1 31.88,29.97 34.29,29.97 34.93,30.61 41.53,30.61 46.36,25.78 46.86,25.78 v47.05,25.59 | ZU4.28 62.87,16.26 v61.85,17.27
  Bottom 0.254: JP1.10 20.22,49.35 22.12,49.35 24.64,46.86
  Bottom 0.305: v61.85,17.27 47.88,17.27 46.36,18.8 46.36,25.02 v47.05,25.59 | v31.88,30.1 31.88,32 34.16,34.29 34.16,41.78 29.08,46.86 24.64,46.86
AREF  (via drill 0.61)
  Top 0.406: JP1.8 23.88,50.55 v25.27,49.15 25.27,45.47 25.27,44.73 C4.2
  Bottom 0.406: ZU4.21 43.43,10.92 39.24,10.92 38.73,11.43 38.73,13.72 37.97,14.48 30.86,14.48 29.59,15.75 29.08,15.75 26.92,17.91 26.92,19.81 25.78,20.95 25.78,21.97 27.94,24.13 27.94,24.64 34.54,31.24 34.93,31.24 35.69,32 35.69,42.67 29.84,48.51 25.91,48.51 v25.27,49.15
CH_PD  (via drill 0.25)
  Top 0.2: U4.7 69.55,37.35 69.7,37.2 69.9,37 v69.9,36.9
  Bottom 0.2: 69.4,12.94 69.47,12.87 | 69.47,12.87 70.27,12.08 73.7,8.64 JP4.2 | v69.9,36.9 69.9,36.7 69.4,36.2 68.8,36.2 68.5,35.9 68.5,33.1 69,32.6 69.1,32.5 69.1,13.24 69.47,12.87
CMP
  Top 0.305: U5.3 23.04,20.64 23.24,20.45 27.69,20.45 27.94,20.7 27.94,22 RN1.1 29.15,22.68 29.21,22.73 29.34,22.73 29.97,23.37 29.21,23.37 29.1,23.48 RN1.2
D+
  Top 0.305: Z1.1 12.1,38.1 RN3.5
  Top 0.406: 7.62,41.15 8.76,41.15 10.16,39.75 10.16,38.74 10.87,38.03 RN3.5
  Top 0.61: X2.3 6.52,40.05 7.62,41.15
  Bottom 0.61: X2.3 6.5,39.37
D-
  Top 0.406: 9.82,37.81 10.79,36.83 10.79,36.2 11.36,35.63 RN3.8 13.49,34.29 Z2.1
  Top 0.61: X2.2 8.53,39.1 9.82,37.81
  Bottom 0.305: X2.2 8.51,39.36
DTR  (via drill 0.61)
  Top 0.254: v25.15,37.59 25.65,38.1 27.19,38.1
  Top 0.305: 26.42,29.84 C5.1 | 27.19,38.1 RN2.4 | U3.13 23.62,34.92 25.15,36.45 v25.15,37.59
  Top 0.406: v25.91,29.84 26.42,29.84
  Bottom 0.406: v25.15,37.59 25.15,30.61 v25.91,29.84
GATE_CMD  (via drill 0.61)
  Top 0.305: U5.1 21.42,19.34 v22.35,18.41
  Top 0.406: T1.3 10.52,25.55 10.92,25.15 10.92,22.61 11.62,21.91 v11.87,21.65 12.06,21.46
  Bottom 0.406: v22.35,18.41 20.95,19.81 13.72,19.81 v11.87,21.65
GND  (via drill 0.3, 0.6, 0.61)
  Top 0.254: U2.4 59.86,41.16 v59.6,40.9
  Top 0.279: C11.2 22.1,30.61 19.81,30.61 19.18,31.24 19.18,32.26
  Top 0.305: POWER.6 POWER.7 | U1.1 12.45,15.14 | U3.3 19.19,33.52 v19.04,33.9 U3.33
  Top 0.406: C4.1 28.25,44.65 v28.3,44.6 | C7.2 v29.97,31.5 | ANT1.GND 75.55,36.35 73.8,34.6 73.21,34.01 L2.1
  Top 0.61: PC1.- 25.43,7.77 v25.5,7.7 23.3,7.7 22.3,8.7 21.53,9.47 C3.1
  Bottom 0.305: GROUND.1 10.79,40.64
  other vias: 30.63,34.32 54.61,49.15 30.35,37.62 11.43,12.7 41.17,17.93 51.44,21.59 43.69,50.8 48.26,2.54 59.44,27.94 67.21,10.69 12.06,24.77 23.11,21.72 10.41,49.91 18.92,26.16 15.6,17.83 8.7,10.83 21.2,15.93 47.6,28.8 48.8,30.4 44.5,23.6 48.16,4.74 20.17,4.63 43.26,5.24 31.96,34.84 69,40.2 67.3,41.2 63.6,43.5 64.9,48.6 73.5,46.7 73.5,44.8 73.4,48.5 73.3,50.1 73.3,51.9 57.5,40.2 75.2,33.5 74.3,31.3 63.5,33.9 43.6,36.6 43.7,35 51.7,27.8 51.8,25.6 69,4.9 69,2.4 71.3,2.4 71.3,4.9 20.7,11.3 22.1,11.3
  pour Top (isolate 0.254, rank 2): -1,56 -1,-1 78,-1 78,35 75,35 75,56
  pour Bottom (isolate 0.254, rank 2): -1,58 -1,-1 78,-1 78,35 75,35 75,58
GPIO0  (via drill 0.25)
  Top 0.2: U4.15 71.15,41.45 71.3,41.6 v71.3,42.6
  Bottom 0.2: JP4.9 74.68,26.42 73.8,27.3 72.9,28.2 72.9,29.3 72.9,31.9 72.9,32.8 74.9,34.8 74.9,37 74.9,39.8 74.9,41.8 73.4,43.3 72.1,43.3 72,43.3 v71.3,42.6
GPIO2  (via drill 0.25)
  Top 0.2: U4.14 71.35,40.95 71.7,41.3 71.7,41.6 v72.5,42.4
  Bottom 0.2: JP4.8 74.02,23.88 73.3,24.6 72.4,25.5 72.4,33.2 74.4,35.2 74.4,41.4 73.4,42.4 v72.5,42.4
GPIO12  (via drill 0.25)
  Top 0.2: U4.10 71.45,38.95 v71.8,38.6
  Bottom 0.2: v71.8,38.6 72.1,38.6 72.7,38 72.7,37.7 72.7,37.2 72.7,36.3 72.7,36.1 70.9,34.3 70.9,18.96 71.8,18.06 73.6,16.26 JP4.5
GPIO13  (via drill 0.25)
  Top 0.2: U4.12 71.35,39.95 71.75,39.95 71.8,40 72.3,40.5 72.4,40.5 v72.9,40.5
  Bottom 0.2: v72.9,40.5 73.3,40.1 73.3,36 72.3,35 71.6,34.3 71.4,34.1 71.4,20.4 72.9,18.9 74.9,18.9 JP4.6
GPIO14  (via drill 0.25)
  Top 0.2: U4.9 70.95,38.45 71.05,38.35 v71.9,37.5
  Bottom 0.2: v71.9,37.5 71.9,36.7 71.2,36 70.9,35.7 70.9,35.1 70.4,34.6 70.4,15.8 72.4,13.8 74.92,13.8 JP4.4
GPIO15  (via drill 0.25)
  Top 0.2: U4.13 71.25,40.45 71.55,40.45 72.1,41 72.6,41.5 v73,41.5
  Bottom 0.2: JP4.7 73.66,21.34 72.9,22.1 72.8,22.2 71.9,23.1 71.9,33.7 72.8,34.6 73.9,35.7 73.9,40.6 v73,41.5
GPIO16  (via drill 0.25)
  Top 0.2: U4.8 70.3,37.9 70.6,37.6 v70.8,37.4 | 62.8,35.8 R8.2 62.8,35.5 63.1,35.2 63.8,35.2 66.2,32.8 66.8,32.8 68.2,32.8 68.3,32.9 69.2,33.8 v69.2,33.6
  Bottom 0.2: v70.8,37.4 70.8,36.5 70.6,36.3 70.4,36.1 70.4,35.2 69.9,34.7 | 69.9,34.7 69.9,14.4 73.1,11.2 73.12,11.18 JP4.3 | 69.9,34.7 69.2,34 v69.2,33.6
IO0  (via drill 0.61)
  Top 0.305: RN4.2 60.73,33.38 v61.21,32.89
  Bottom 0.406: ZU4.2 60.2,20.19 55.88,24.51 55.88,29.34 56.64,30.1 59.31,30.1 61.21,32 v61.21,32.89 60.83,33.27 58.93,33.27 57.91,34.29 57.91,35.56 56.26,37.21 56.26,44.96 58.17,46.86 59.18,46.86 60.45,48.13 60.71,48.13 62.23,49.66 62.36,49.66 IOL.1
IO1  (via drill 0.61)
  Top 0.406: RN4.1 59.09,32.04 58.67,31.62 56.64,31.62 v56.34,31.32
  Bottom 0.406: ZU4.3 57.79,21.08 55.14,23.72 55.14,29.74 56.39,30.99 56.39,31.11 v56.34,31.32 56.39,31.37 56.39,33.66 55.37,34.67 55.37,45.47 57.66,47.75 58.67,47.75 59.82,48.9 59.82,49.66 IOL.2
IO2
  Bottom 0.406: ZU4.4 55.25,21.84 54.23,22.86 54.23,29.84 54.86,30.48 54.86,34.04 54.48,34.42 54.48,45.97 57.15,48.64 57.15,49.53 IOL.3
IO3
  Bottom 0.406: ZU4.5 52.7,20.7 53.34,21.34 53.34,30.48 53.72,30.86 53.72,34.04 53.59,34.16 53.59,46.48 55.88,48.77 IOL.4
IO4
  Bottom 0.305: 50.16,26.8 50.16,28.77 52.8,31.4 52.8,50.26 IOL.5
  Bottom 0.406: 53.21,50.29 IOL.5 | ZU4.6 50.16,26.8
IO5
  Bottom 0.305: 50.8,50.29 50.8,50.1 52,48.9 52,34.1 50.7,32.8 48.68,32.8 48.64,32.77
  Bottom 0.406: 50.8,50.29 IOL.6 | ZU4.11 37.47,21.59 48.64,32.77
IO6
  Bottom 0.305: 48.26,50.29 48.26,50.04 49.4,48.9 50.8,48.9 51.1,48.6 51.2,48.5 51.2,34.4 50.4,33.6 48.2,33.6 47.5,32.89
  Bottom 0.406: 48.26,50.29 IOL.7 | ZU4.12 34.93,20.32 47.5,32.89
IO7
  Bottom 0.305: 45.72,50.04 45.96,50.04 47.7,48.3 47.9,48.1 49.8,48.1 50.3,47.6 50.4,47.5 50.4,34.9 49.9,34.4 47.73,34.4 46.32,32.98
  Bottom 0.406: 45.72,50.04 IOL.8 | ZU4.13 32.39,20.32 34.93,22.86 36.2,22.86 46.32,32.98 46.36,33.02
IO8
  Bottom 0.406: ZU4.14 29.84,20.32 33.27,23.75 35.81,23.75 41.91,29.84 41.91,50.55 41.66,50.29 JP1.1
IO9  (via drill 0.61)
  Top 0.406: ZU4.15 29.84,17.4 31.11,18.67 31.11,21.21 32.39,22.48 v32.39,24.89
  Bottom 0.406: v32.39,24.89 35.69,24.89 40.64,29.84 40.64,49.02 39.12,50.55 JP1.2
L13  (via drill 0.61)
  Top 0.305: U5.7 15.95,19.99 15.88,20.07 15.88,20.57 15.95,20.64 U5.6 18.48,20.64 18.54,20.7 v18.92,21.08 | RN2.8 30.28,40.57 v30.86,41.15
  Bottom 0.305: v30.86,41.15 29.21,39.5 29.21,35.81 27.05,33.66 27.05,24.26 25.15,22.35 25.15,20.7 24.13,19.68 22.1,19.68 21.08,20.7 19.3,20.7 v18.92,21.08
M8RXD
  Top 0.279: U3.9 24.54,32.92 24.76,33.15
  Top 0.305: RN4.7 53.7,33.38 52.79,34.16 52.45,34.16 51.94,33.66 31.5,33.66 30.99,33.15 24.76,33.15
M8TXD
  Top 0.254: RN4.8 53.52,32.58 53.09,33.02 52.32,33.02 51.31,32 51.05,32
  Top 0.279: U3.8 24.85,32.22 25.15,32.51
  Top 0.305: 25.15,32.51 31.37,32.51 31.88,33.02 50.04,33.02 51.05,32
MISO  (via drill 0.61)
  Top 0.406: v37.72,16.38 37.72,12.83 ZU4.18
  Bottom 0.406: JP1.5 31.5,50.55 37.59,44.07 37.59,31.11 35.94,29.46 35.31,29.46 31.11,25.27 31.11,22.73 30.23,21.84 29.08,21.84 28.57,21.34 28.57,18.8 29.84,17.53 30.86,17.53 32,16.38 v37.72,16.38 | ICSP.1 63.45,30.43 61.34,28.32 61.34,24.26 64.26,21.34 64.26,17.78 62.74,16.26 45.97,16.26 44.96,15.24 39.88,15.24 38.73,16.38 v37.72,16.38 | v37.72,16.38 37.85,16.13 37.85,16.26
MISO2  (via drill 0.61)
  Top 0.254: v22.22,41.02 22.22,39.5
  Top 0.279: 21.84,37.59 21.69,37.44 U3.17
  Top 0.305: v22.22,41.02 22.22,37.97 21.84,37.59
  Bottom 0.254: v22.22,41.02 22.22,42.93 21.46,43.69 20.19,43.69 19.56,44.32 19.56,45.72 20.83,46.99 ICSP1.1
MOSI  (via drill 0.61)
  Top 0.406: ZU4.17 34.93,16.89 36.22,18.19 36.22,21.51 34.8,22.99 34.8,26.54 35.05,26.8 v36.32,28.32 | S1.2 35.07,39.07 34.5,39.64 34.5,50.34 JP1.4
  Bottom 0.381: 64.9,23.09 64.9,26.57
  Bottom 0.406: JP1.4 34.04,50.42 38.61,45.85 38.61,30.99 36.32,28.7 v36.32,28.32 | ICSP.4 66.18,27.83 64.9,26.57 | 64.9,23.09 65.79,22.22 65.79,17.02 63.25,14.48 46.99,14.48 46.36,13.84 46.36,11.18 45.85,10.67 44.45,10.67 43.94,10.16 37.47,10.16 ZU4.17
MOSI2
  Top 0.254: ICSP1.4 19.56,43.69 21.59,43.69 23.24,42.04 23.24,36.96 22.7,36.42 U3.16
N$1
  Top 0.279: 26.67,42.16 L.A
  Top 0.305: 26.67,42.16 26.67,41.17 RN2.1
N$2
  Top 0.2: U4.32 63.33,38.45 62.8,37.92 R8.1
N$3
  Top 0.305: RN4.6 56.62,34.18 56.39,34.42 56.39,35.31 56.64,35.05 56.97,34.98 RN4.5
  Top 0.406: 56.39,35.31 54.73,35.31 ON.A
N$4
  Top 0.2: U4.31 62.63,38.95 R7.1
N$8
  Top 0.254: U4.2 67.05,35.64 L3.2
  Top 0.406: 67.05,35.64 68.66,35.64 C14.1
N$9
  Top 0.2: U4.28 63.6,40.45 U2.1 62.9,41.15 62.9,40.1 62.3,39.5 C10.1
N$10
  Top 0.2: U4.21 68.05,43.47 R9.2
N$11
  Top 0.2: U4.27 64.45,40.95 64,41.4 64,42.1 63.8,42.3 62.15,42.3 61.11,43.34 U2.3
  Top 0.254: C12.1 61.07,43.48 U2.3
N$35
  Top 0.305: RX.A 28.96,34.29 28.96,34.42 30.23,35.69 31.37,35.69 32.39,36.7 32.39,39.12 31.73,39.77 RN2.7
N$36
  Top 0.305: TX.A 29.25,36.57 30.85,36.57 31.75,37.47 31.75,38.35 31.37,38.74 31.13,38.97 RN2.6
PB4
  Top 0.279: U3.18 21.19,39.52
  Top 0.305: 21.19,39.52 JP2.1
PB5
  Top 0.279: 20.83,41.78 19.56,40.51 19.56,39.32 20.69,38.19 U3.19
  Top 0.305: 20.83,41.78 JP2.3
PB6
  Top 0.279: U3.20 20.19,37.83 18.29,39.73 JP2.2
PB7
  Top 0.279: 17.78,38.48 18.77,38.48 19.69,37.56 U3.21
  Top 0.305: JP2.4 18.29,41.78 17.02,40.51 17.02,39.24 17.78,38.48
PWRIN
  Top 0.813: X1.2 12.59,8.31 14,6.9 17.58,6.9 D1.A
RD+
  Top 0.279: U3.29 16,34.42 14.35,36.07
  Top 0.305: 14.35,36.07 14.35,37.97 14.29,38.03 RN3.4
RD-
  Top 0.254: RN3.1 13.53,35.63
  Top 0.279: U3.30 15.34,33.92 RN3.1
RESET  (via drill 0.61)
  Top 0.305: C5.2 28.83,29.46 27.18,27.81 RESET-EN.1
  Top 0.406: RESET-EN.2 RESET-EN.1 | ICSP.5 63.64,23.25 62.87,22.48 ZU4.1 | POWER.3 32.51,3.05 32.51,7.49 28.57,11.43 28.57,21.34 29.08,21.84 30.23,21.84 31.11,22.73 31.11,24.89 RESET-EN.2 | RN1.4 28.61,27.85 RESET-EN.2 | RESET.3 2.89,47.66 3.68,46.86 8,46.86 8.76,47.62 v8.89,47.66 RESET.4 | RESET-EN.2 33.02,27.3 35.56,29.84 41.15,29.84 46.99,24 58.67,24 v59.44,24.77 D2.A | v30.23,29.34 30.23,28.83 RESET-EN.2
  Bottom 0.254: v8.89,47.66 9.89,48.67 10.05,48.64 12.7,48.64 15.11,46.23 16.38,46.23 17.02,46.86 17.02,48.01 17.8,48.79 21.82,48.79 23.88,46.74
  Bottom 0.305: 23.88,46.74 24.51,46.1 28.7,46.1 33.4,41.4 33.4,34.67 31.11,32.39 31.11,30.99 30.23,30.1 v30.23,29.34
  Bottom 0.406: v59.44,24.77 62.87,21.34 ZU4.1
RESET2  (via drill 0.61)
  Top 0.305: v22.61,46.61 22.61,47.62 21.46,48.77 17.02,48.77 ICSP1.5 13.51,47.5 D3.A 13.08,46.4 12.37,46.4 11.56,45.59 11.56,45.39 11.56,43.82 12.06,43.31 15.37,43.31 16.26,42.42 16.26,37.72 16.85,37.12 U3.24
  Top 0.406: RN1.6 26.18,24.28 26.16,24.26 v25.84,24.53 v25.83,24.54
  Bottom 0.406: v22.61,46.61 22.86,46.36 22.86,44.58 23.88,43.56 23.88,42.29 24.38,41.78 25.53,41.78 26.03,41.28 26.03,40.13 24,38.1 24,30.23 26.16,28.07 26.16,24.87 v25.83,24.54
RXD_M1
  Top 0.2: U4.25 65.25,41.95 65,42.2 65,44.8 64.4,45.4 58.2,45.4 57.2,44.4
  Top 0.254: Q2.2 52.68,43.89 R5.2 56.69,43.89 57.2,44.4
RXLED
  Top 0.279: RX.C 25.02,34.29 24.15,33.42 U3.10
SCK  (via drill 0.61)
  Top 0.305: v26.92,21.46 25.15,21.46 23.75,22.86 18.03,22.86 16.94,21.76 | 16.94,21.76 U5.5 16.94,21.76
  Bottom 0.406: ICSP.3 62.1,26.42 62.1,24.77 65.02,21.84 65.02,17.4 62.99,15.37 46.48,15.37 45.59,14.48 41.53,14.48 40.01,12.95 | 40.01,12.95 40.01,13.97 38.73,15.24 31.75,15.24 30.23,16.76 29.34,16.76 27.81,18.29 27.81,20.07 26.92,20.95 v26.92,21.46 26.92,21.97 28.83,23.88 28.83,24.38 34.8,30.35 35.56,30.35 36.58,31.37 36.58,43.05 28.96,50.67 JP1.6 | 40.01,12.95 ZU4.19
SCK2
  Top 0.254: U3.15 23.47,35.92 24,36.45 24,43.56 21.34,46.23 20.32,46.23 19.05,47.5 ICSP1.3
SD_CLK
  Top 0.2: R9.1 67.7,46.42 U7.6
SD_CMD
  Top 0.2: U4.20 68.55,44.55 68.3,44.8 68.3,48.7 70.2,50.6 U7.1
SD_D0  (via drill 0.3)
  Top 0.2: U4.22 67.55,43.15 67.2,43.5 66.9,43.8 66.7,44 v66.7,44.3 | U7.2 68.94,50.74 v68.3,50.1
  Bottom 0.2: v68.3,50.1 68.3,47.1 66.7,45.5 v66.7,44.3
SD_D1
  Top 0.2: U4.23 67.05,42.85 67.05,42.95 67,43 66.7,43.3 66.2,43.3 65.9,43.6 65.9,45.2 66.2,45.5 66.2,46.26 U7.5 66.3,46.36
SD_D2
  Top 0.2: U4.18 69.55,43.05 70.3,43.8 70.3,44.5 69.9,44.9 69.1,44.9 69,45 69,46.39 U7.7
SD_D3  (via drill 0.3)
  Top 0.2: U4.19 69.05,43.55 69.05,43.85 v69.3,44.1 | U7.3 67.67,50.97 67.1,50.4 v67.1,50.1
  Bottom 0.2: v67.1,50.1 67.1,47.1 65.2,45.2 65.2,43.9 65.6,43.5 68.7,43.5 v69.3,44.1
SS  (via drill 0.61)
  Top 0.406: v33.53,26.04 33.78,25.78 33.78,23.93 33.68,23.82 33.68,18.82 32.39,17.53 ZU4.16 | S1.1 37.2,50.17 JP1.3
  Bottom 0.406: v33.53,26.04 34.42,26.92 36.45,26.92 39.5,29.97 39.5,47.5 36.58,50.42 JP1.3
TOUT  (via drill 0.25)
  Top 0.2: U4.6 69.05,37.05 v68.9,36.9
  Bottom 0.2: JP4.1 73.6,6.1 68.9,10.8 68.6,11.1 68.6,12.4 68.6,32.3 67.9,33 67.9,35.9 v68.9,36.9
TP_VUCAP
  Top 0.279: U3.27 16.98,35.42 15.62,36.78 | 15.62,40.51 15.62,41.28 14.99,41.91 C8.1
  Top 0.305: 15.62,36.78 15.62,40.51
TXD_M1
  Top 0.2: U4.26 64.95,41.45 64.5,41.9 64.5,44.5 64.1,44.9 58.4,44.9 57.7,44.2
  Top 0.254: Q1.2 52.7,40.09 R3.2 54.45,40.15 57.6,43.3 57.6,44.1 57.7,44.2
TXLED
  Top 0.279: U3.11 23.51,33.92 26.16,36.58 TX.C
UGND
  Top 0.279: U3.28 16.51,34.92 14.99,36.45
  Top 0.305: 14.99,36.45 14.99,39.88 14.22,40.64
  Top 0.406: C8.2 11.81,41.28 12.45,40.64 14.22,40.64
  Top 0.61: L1.1 8.72,45 C8.2
  Top 0.813: L1.1 8.85,44.41 4.45,40.01 4.45,37.47 5.08,36.83 6.5,36.83 X2.4
  Bottom 0.61: X2.4 6.5,36.83
  Bottom 0.813: X2.4 5.06,36.85 4.45,37.47 4.45,40.01 5.71,41.28 10.03,41.28 GROUND.2
USBVCC
  Top 0.305: U3.31 16.78,33.42 16.64,33.27
  Top 0.406: 16.64,33.27 15.37,33.27 14.48,32.39 11.43,32.39 9.91,30.86 9.91,28.96 10.54,28.32 10.54,27.18 9.88,26.52 T1.1 | 4.47,24.51 4.06,24.51 F1.1
  Top 0.813: 3.47,24.51 4.47,24.51 T1.1
USHIELD  (1 unrouted)
  Top 0.61: 9.02,42.8 9.02,42.67 11.7,39.99 Z1.2 | 11.06,33.54 11.19,33.54 11.3,33.66 Z2.2
  Top 0.813: L1.2 4.79,45.09 X2.P$1 | 11.06,33.54 5.25,33.54 X2.P$2
  Bottom 0.61: X2.P$1 5.11,42.8
  Bottom 0.813: X2.P$1 3.81,44.07 2.67,42.93 2.67,33.27 3.81,32.13 X2.P$2
VIN  (via drill 0.6, 0.61)
  Top 0.305: RN1.8 24.82,22.68 24,23.5 17.53,23.5 14.1,23.5 13.1,22.5 13.1,19.81 13,19.71
  Top 0.61: U1.3 13,19.71 13.2,19.71 v13.2,11.7 | D1.C 17.61,2.79 15.5,4.9 v15.4,5
  Top 0.813: v48.26,8.25 46.36,8.25 45.72,7.62 POWER.8 | D1.C 23.38,2.47 PC1.+ 25.37,2.97 29.1,6.7 v29.1,7.4
  Bottom 0.61: v15.4,5 15.4,9.5 v13.2,11.7
  Bottom 0.813: v29.1,7.4 47.41,7.4 v48.26,8.25
WIFI_ANT
  Top 0.254: 71.31,35.7 L2.2
  Top 0.406: C14.2 71.31,35.7 L2.2 72.09,35.79 arc90 73.3,37 73.3,37.8 arc-90 ANT1.RF
XT1
  Top 0.254: R1.1 18.29,29.72
  Top 0.279: 18.19,29.75 U3.1
  Top 0.305: R1.1 18.19,29.75
  Top 0.406: C9.1 16.89,26.67 16.51,26.67 Y1.2
  Top 0.61: C9.1 R1.1
XT2
  Top 0.279: 18.69,30.84 U3.2
  Top 0.305: R1.2 18.69,30.84
  Top 0.406: R1.2 C11.1 21.34,26.8 21.46,26.67 Y1.1
XTAL1
  Top 0.406: ZU4.9 42.55,22.35 R2.1 42.27,22.84 Y2.3
XTAL2
  Top 0.406: ZU4.10 40.01,22.35 R2.2 40.27,22.84 Y2.1
XUSB
  Top 0.813: F1.2 2.5,28.49 1.4,29.59 1.4,33.78 2.54,34.93 7.62,34.93 8.51,35.81 X2.1

### Text on the board
tPlace: 13 | 12 | 11 | 10 | 9 | 8 | 7 | 6 | 5 | 4 | 3 | 2 | 1 | 0 | CREATE SOMETHING | GND | GPIO0 | GPIO2 | GPIO15 | GPIO13 | GPIO12 | GPIO14 | GPIO16 | CH_PD | TOUT
tNames: AREF | GND | # | [#=PWM] | # | # | # | TX | RX | # | # | DIGITAL | TX | RX | 1 | ANALOG IN | IOREF | RESET | 3V3 | 5V | GND | VIN | A0 | A1 | A2 | A3 | A4 | A5
ReferenceLC: L | TX | ON | RX | PC2 | PC1
201bmp: E:/CLOUD_STORAGE/OneDrive/Projects/Priority/Direct/International/Arun_Arduino_Shield2/16HertzLogo.bmp | E:/CLOUD_STORAGE/OneDrive/Projects/Priority/Direct/International/Arun_Arduino_Shield2/16HertzLogo1.bmp
214bmp: D:/SmartProjects/Snc/a4_bn_logo2.bmp